# Altium project LithiumBatteryPack.PrjPCB
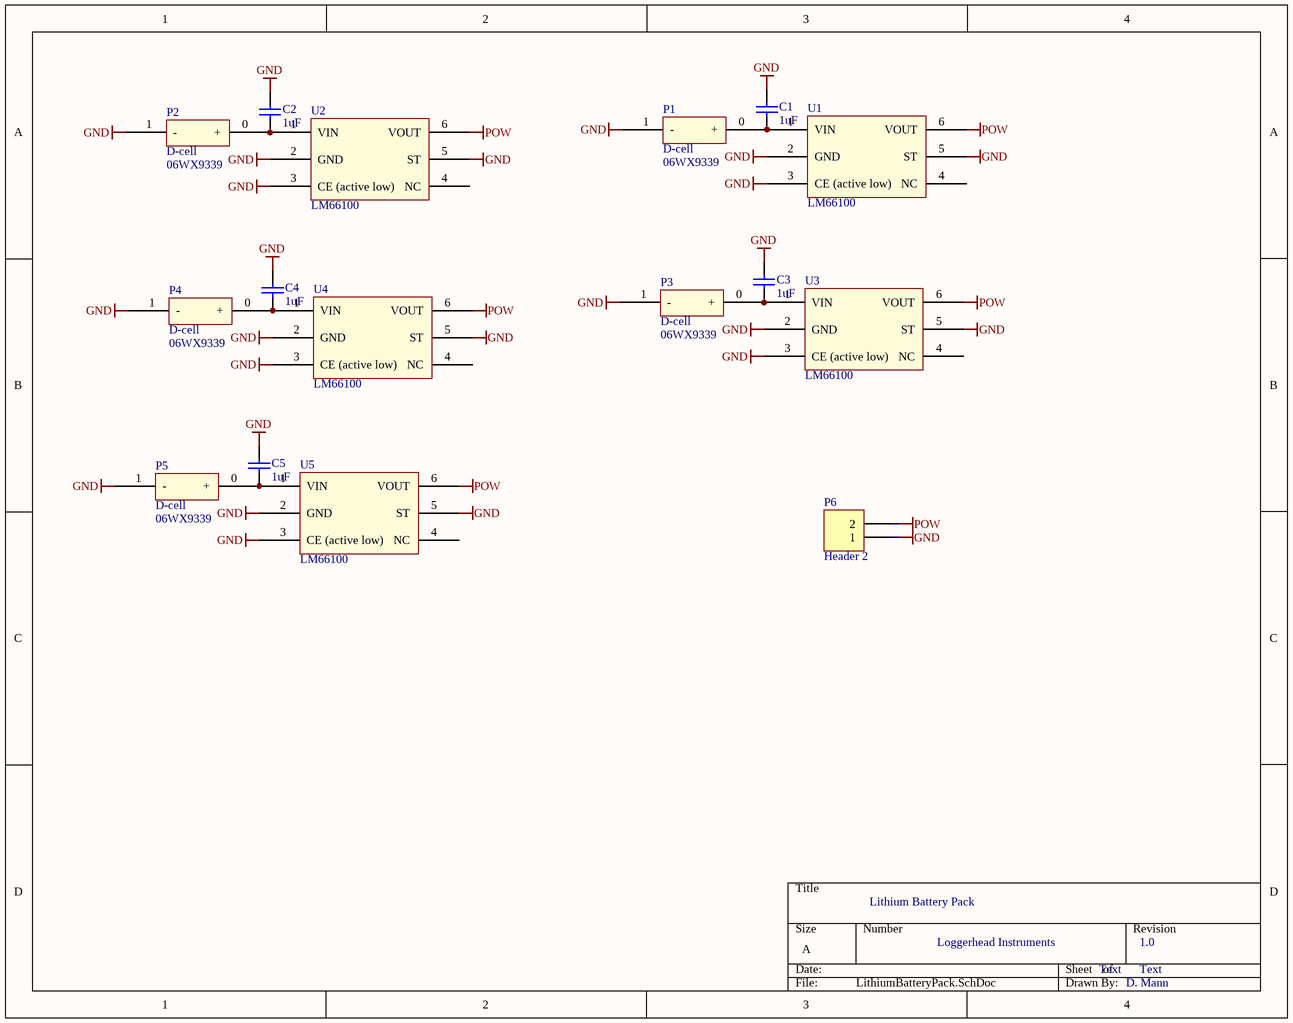
[diagram p0: LithiumBatteryPack.SchDoc]
1 sheet, 16 parts. Net scope: global (net labels, ports and power ports of the same name join across sheets).
Board file: LithiumBatteryPack.PcbDoc

## Sheet LithiumBatteryPack.SchDoc
size A

### Parts
C1  1uF  [0402]
C2  1uF  [0402]
C3  1uF  [0402]
C4  1uF  [0402]
C5  1uF  [0402]
P1  D-cell  Supplier Part Number 1: 06WX9339  [Battery-D]
P2  D-cell  Supplier Part Number 1: 06WX9339  [Battery-D]
P3  D-cell  Supplier Part Number 1: 06WX9339  [Battery-D]
P4  D-cell  Supplier Part Number 1: 06WX9339  [Battery-D]
P5  D-cell  Supplier Part Number 1: 06WX9339  [Battery-D]
P6  Header 2  [HDR1X2]
U1  LM66100  [SC-70-6]
U2  LM66100  [SC-70-6]
U3  LM66100  [SC-70-6]
U4  LM66100  [SC-70-6]
U5  LM66100  [SC-70-6]

### Nets
GND: C1.1 C2.1 C3.1 C4.1 C5.1 P1.1(-) P2.1(-) P3.1(-) P4.1(-) P5.1(-) P6.1 U1.2(GND) U1.3(CE_(active_low)) U1.5(ST) U2.2(GND) U2.3(CE_(active_low)) U2.5(ST) U3.2(GND) U3.3(CE_(active_low)) U3.5(ST) U4.2(GND) U4.3(CE_(active_low)) U4.5(ST) U5.2(GND) U5.3(CE_(active_low)) U5.5(ST)
POW: P6.2 U1.6(VOUT) U2.6(VOUT) U3.6(VOUT) U4.6(VOUT) U5.6(VOUT)
NetC1_2: C1.2 P1.0(+) U1.1(VIN)
NetC2_2: C2.2 P2.0(+) U2.1(VIN)
NetC3_2: C3.2 P3.0(+) U3.1(VIN)
NetC4_2: C4.2 P4.0(+) U4.1(VIN)
NetC5_2: C5.2 P5.0(+) U5.1(VIN)

Not connected (* = marked no-connect by the designer): U1 4(NC); U2 4(NC); U3 4(NC); U4 4(NC); U5 4(NC)

### Notes on the sheet
- Lithium Battery Pack
- Loggerhead Instruments
- Text
- 1.0
- D. Mann

### Library data of the parts
C1-C5 = C0402: Ceramic Chip Capacitor - Standard; Note: Footprint corresponds to dimensions for bulk cassette packaging. This case size has tightened tolerances.; Value: 0.1uF; Published: 17-Jul-2002; LatestRevisionDate: 19-Mar-2004; LatestRevisionNote: Silkscreen size reduced.; DatasheetDocument: Mar-2001; PackageDocument: Mar-2001; PackageReference: 0402; Publisher: Altium Limited; Code_JEITA: 0402; Code_IPC: 1005 [0402]; ComponentLink1Description: Manufacturer Link; ComponentLink1URL: http://www.kemet.com/; ComponentLink2Description: Datasheet; ComponentLink2URL: http://www.kemet.com/kemet/web/homepage/kechome.nsf/vapubfilesname/F3102TA.pdf/$file/F3102TA.pdf
P1-P5 = Battery-D: Supplier 1: Newark
P6 = Header 2: Header, 2-Pin; LatestRevisionDate: 17-Jul-2002; LatestRevisionNote: Re-released for DXP Platform.; Publisher: Altium Limited